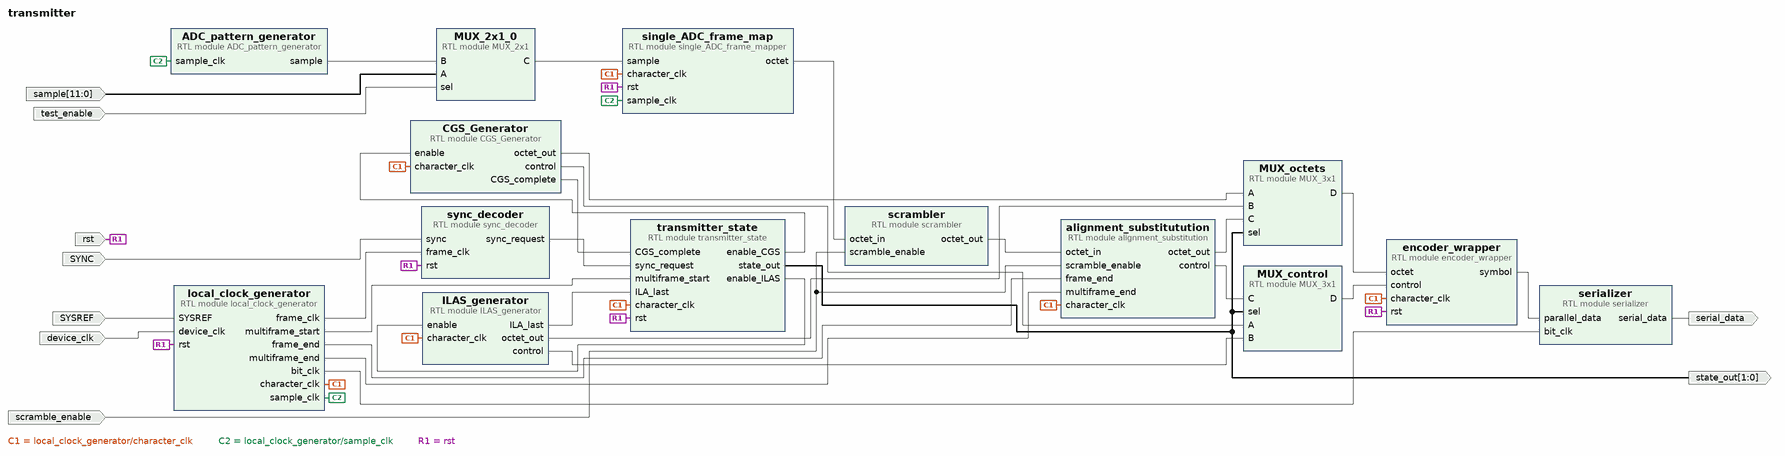
[diagram p0: block diagram of the top level]
# Vivado block design transmitter, xcau15p-ffvb676-2-e, Vivado 2024.1
create_bd_design transmitter

create_bd_port -dir I SYNC
create_bd_port -dir I scramble_enable
create_bd_port -dir I rst
create_bd_port -dir I -from 11 -to 0 sample
create_bd_port -dir O serial_data
create_bd_port -dir I SYSREF
create_bd_port -dir I test_enable
create_bd_port -dir O -from 1 -to 0 state_out
create_bd_port -dir I -type clk device_clk

create_bd_cell -type module -reference local_clock_generator local_clock_generator
create_bd_cell -type module -reference scrambler scrambler
create_bd_cell -type module -reference transmitter_state transmitter_state
create_bd_cell -type module -reference ILAS_generator ILAS_generator
create_bd_cell -type module -reference CGS_Generator CGS_Generator
create_bd_cell -type module -reference MUX_3x1 MUX_control
set_property -dict {CONFIG.width 1} [get_bd_cells MUX_control]
create_bd_cell -type module -reference MUX_3x1 MUX_octets
create_bd_cell -type module -reference encoder_wrapper encoder_wrapper
create_bd_cell -type module -reference single_ADC_frame_mapper single_ADC_frame_map
create_bd_cell -type module -reference sync_decoder sync_decoder
create_bd_cell -type module -reference serializer serializer
create_bd_cell -type module -reference ADC_pattern_generator ADC_pattern_generator
create_bd_cell -type module -reference alignment_substitution alignment_substitutution
create_bd_cell -type module -reference MUX_2x1 MUX_2x1_0
set_property -dict {CONFIG.width 12} [get_bd_cells MUX_2x1_0]

# ---- connections ----

connect_bd_net [get_bd_pins ADC_pattern_generator/sample] [get_bd_pins MUX_2x1_0/B]
connect_bd_net -net CGS_Generator_0_octet_out [get_bd_pins CGS_Generator/octet_out] [get_bd_pins MUX_octets/A]
connect_bd_net [get_bd_pins CGS_Generator/CGS_complete] [get_bd_pins transmitter_state/CGS_complete]
connect_bd_net [get_bd_pins CGS_Generator/control] [get_bd_pins MUX_control/A]
connect_bd_net [get_bd_pins ILAS_generator/ILA_last] [get_bd_pins transmitter_state/ILA_last]
connect_bd_net [get_bd_pins ILAS_generator/control] [get_bd_pins MUX_control/B]
connect_bd_net [get_bd_pins ILAS_generator/octet_out] [get_bd_pins MUX_octets/B]
connect_bd_net [get_bd_pins MUX_2x1_0/C] [get_bd_pins single_ADC_frame_map/sample]
connect_bd_net [get_bd_pins MUX_control/D] [get_bd_pins encoder_wrapper/control]
connect_bd_net [get_bd_pins MUX_octets/D] [get_bd_pins encoder_wrapper/octet]
connect_bd_net [get_bd_ports SYNC] [get_bd_pins sync_decoder/sync]
connect_bd_net -net SYSREF_0_1 [get_bd_ports SYSREF] [get_bd_pins local_clock_generator/SYSREF]
connect_bd_net -net alignment_substituti_0_control [get_bd_pins alignment_substitutution/control] [get_bd_pins MUX_control/C]
connect_bd_net -net alignment_substituti_0_octet_out [get_bd_pins alignment_substitutution/octet_out] [get_bd_pins MUX_octets/C]
connect_bd_net -net device_clk_0_1 [get_bd_ports device_clk] [get_bd_pins local_clock_generator/device_clk]
connect_bd_net -net encoder_wrapper_0_symbol [get_bd_pins encoder_wrapper/symbol] [get_bd_pins serializer/parallel_data]
connect_bd_net [get_bd_pins local_clock_generator/bit_clk] [get_bd_pins serializer/bit_clk]
connect_bd_net [get_bd_pins local_clock_generator/character_clk] \
  [get_bd_pins CGS_Generator/character_clk] [get_bd_pins ILAS_generator/character_clk] \
  [get_bd_pins alignment_substitutution/character_clk] [get_bd_pins encoder_wrapper/character_clk] \
  [get_bd_pins single_ADC_frame_map/character_clk] [get_bd_pins transmitter_state/character_clk]
connect_bd_net [get_bd_pins local_clock_generator/frame_clk] [get_bd_pins sync_decoder/frame_clk]
connect_bd_net [get_bd_pins local_clock_generator/frame_end] [get_bd_pins alignment_substitutution/frame_end]
connect_bd_net [get_bd_pins local_clock_generator/multiframe_end] [get_bd_pins alignment_substitutution/multiframe_end]
connect_bd_net [get_bd_pins local_clock_generator/multiframe_start] [get_bd_pins transmitter_state/multiframe_start]
connect_bd_net [get_bd_pins local_clock_generator/sample_clk] \
  [get_bd_pins ADC_pattern_generator/sample_clk] [get_bd_pins single_ADC_frame_map/sample_clk]
connect_bd_net [get_bd_ports sample] [get_bd_pins MUX_2x1_0/A]
connect_bd_net [get_bd_ports scramble_enable] [get_bd_pins alignment_substitutution/scramble_enable] [get_bd_pins scrambler/scramble_enable]
connect_bd_net [get_bd_pins scrambler/octet_out] [get_bd_pins alignment_substitutution/octet_in]
connect_bd_net -net sel_0_1 [get_bd_ports test_enable] [get_bd_pins MUX_2x1_0/sel]
connect_bd_net -net serializer_0_serial_data [get_bd_pins serializer/serial_data] [get_bd_ports serial_data]
connect_bd_net -net single_ADC_frame_map_0_octet [get_bd_pins single_ADC_frame_map/octet] [get_bd_pins scrambler/octet_in]
connect_bd_net -net sync_decoder_0_sync_request [get_bd_pins sync_decoder/sync_request] [get_bd_pins transmitter_state/sync_request]
connect_bd_net -net transmitter_state_0_enable_ILAS [get_bd_pins transmitter_state/enable_ILAS] [get_bd_pins ILAS_generator/enable]
connect_bd_net -net transmitter_state_enlable_CGS [get_bd_pins transmitter_state/enable_CGS] [get_bd_pins CGS_Generator/enable]
connect_bd_net [get_bd_pins transmitter_state/state_out] [get_bd_ports state_out] [get_bd_pins MUX_control/sel] [get_bd_pins MUX_octets/sel]
connect_bd_net -net util_vector_logic_0_Res [get_bd_ports rst] \
  [get_bd_pins single_ADC_frame_map/rst] [get_bd_pins encoder_wrapper/rst] [get_bd_pins transmitter_state/rst] \
  [get_bd_pins sync_decoder/rst] [get_bd_pins local_clock_generator/rst]

set_property USER_COMMENTS.comment_0 {TODOs
delay in ilas transition
rst with clock generator} [current_bd_design]

validate_bd_design
save_bd_design
